# Altium project data_logger.PrjPcb
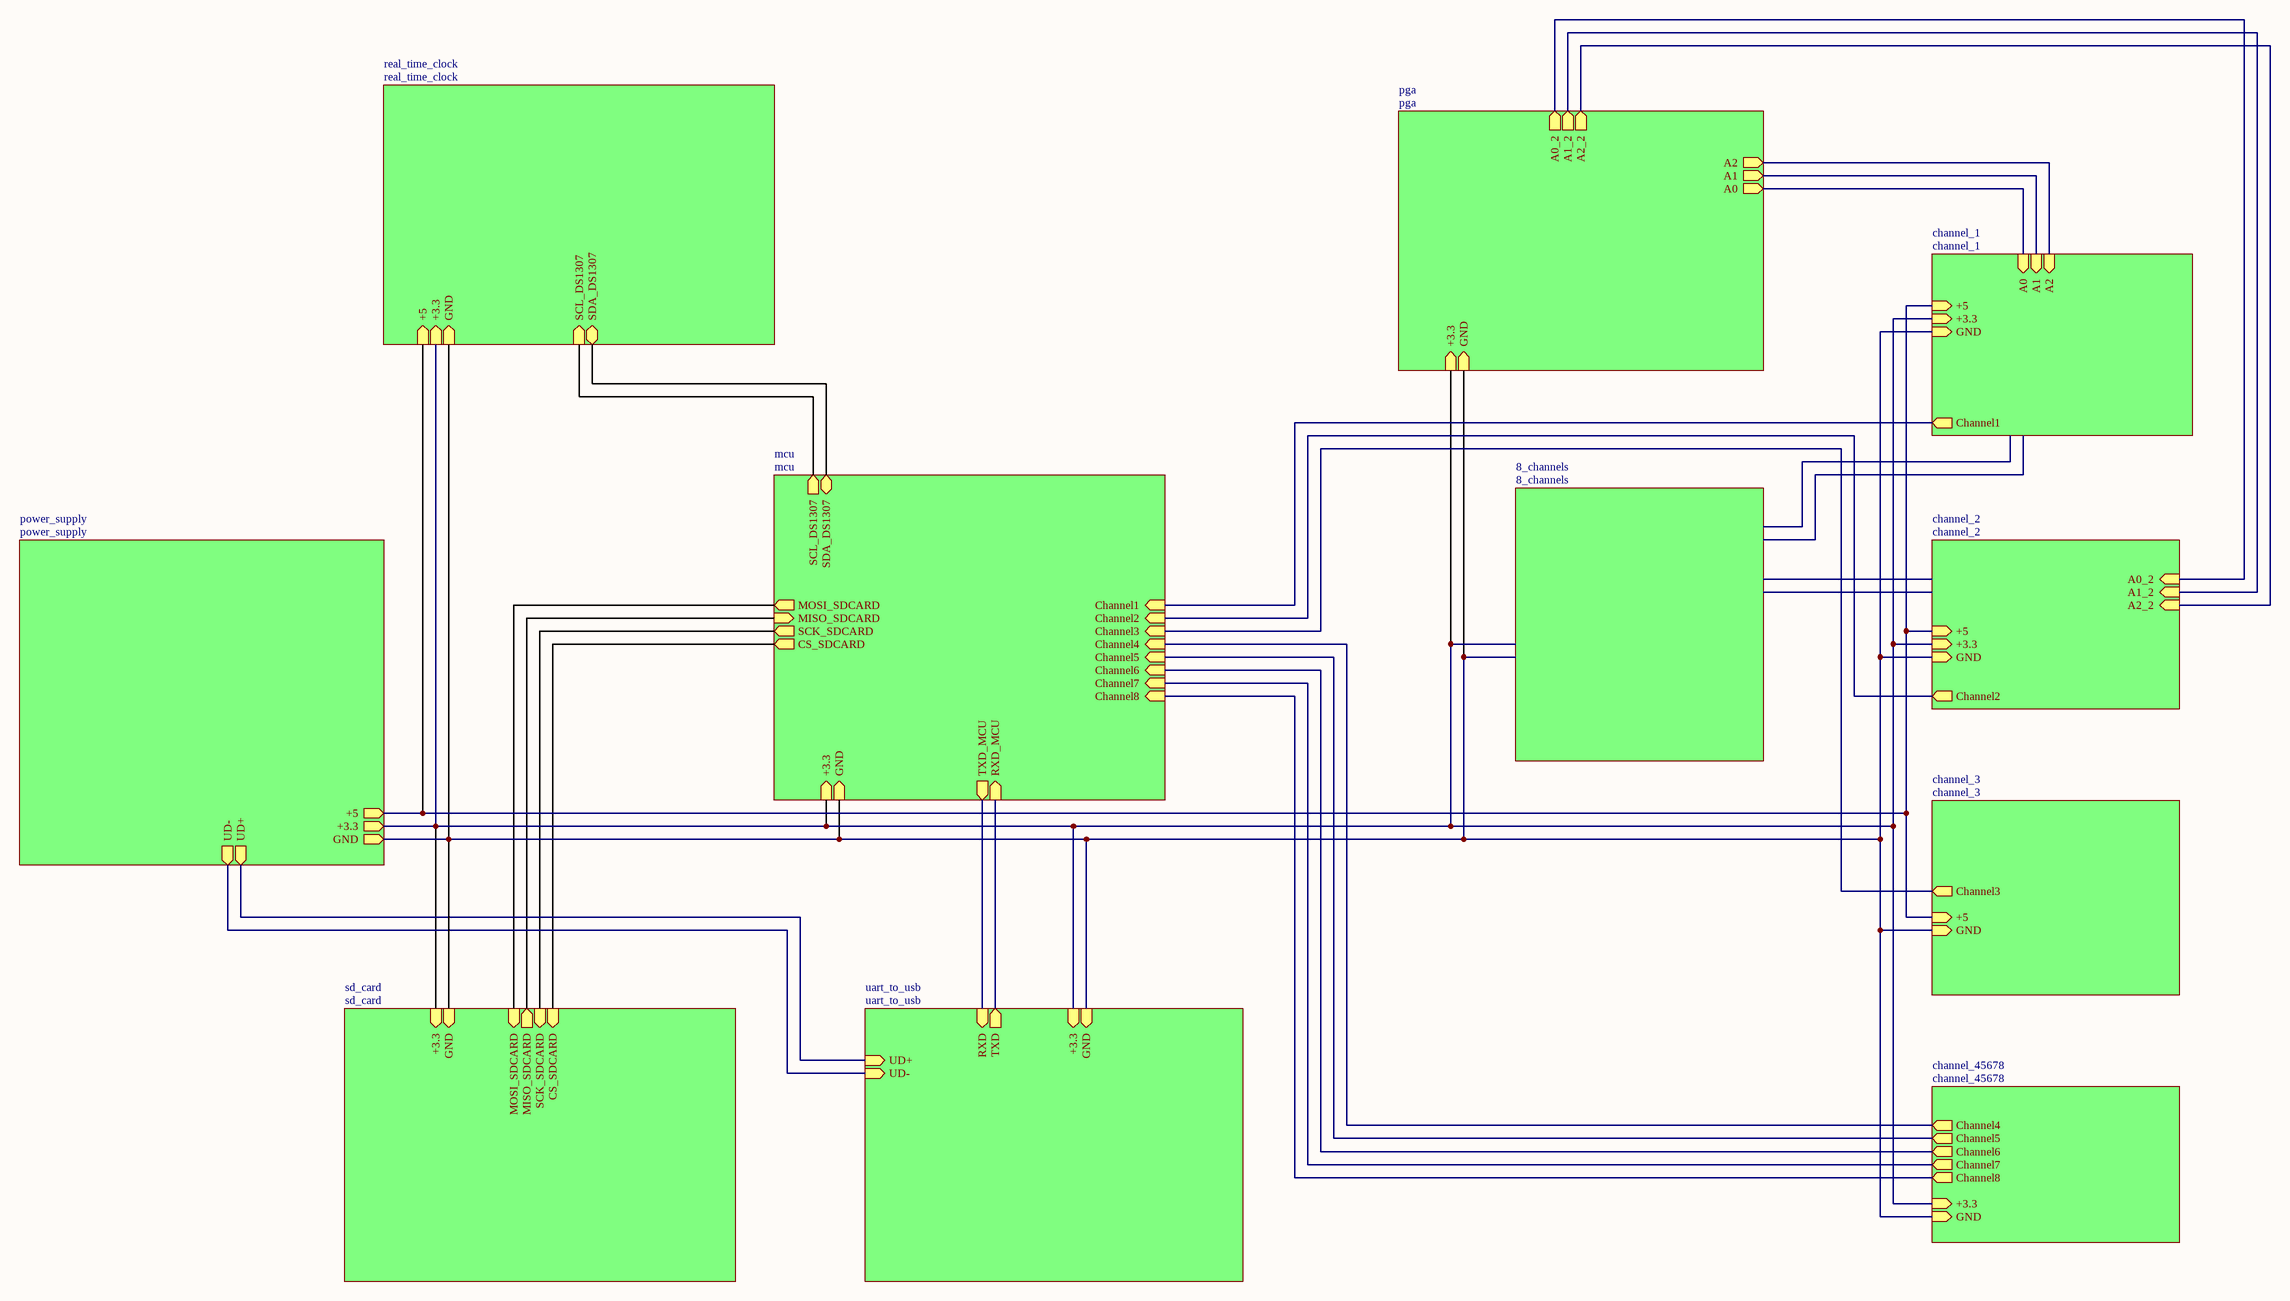
[diagram p0: data_logger.SchDoc]
12 sheets, 179 parts. Net scope: hierarchical (ports join the sheet entries above them; power ports are global).
Board file: data_logger.PcbDoc
Sheets:
  data_logger.SchDoc
    power_supply = power_supply.SchDoc
    real_time_clock = real_time_clock.SchDoc
    pga = pga.SchDoc
    sd_card = sd_card.SchDoc
    uart_to_usb = uart_to_usb.SchDoc
    mcu = mcu.SchDoc
    8_channels = 8_channels.SchDoc
    channel_1 = channel_1.SchDoc
    channel_2 = channel_2.SchDoc
    channel_3 = channel_3.SchDoc
    channel_45678 = channel_45678.SchDoc

## Sheet data_logger.SchDoc
size A2; SheetNumber: 1; SheetTotal: 12

### Sub-sheets
8_channels = 8_channels: no entries
channel_1 = channel_1: A2 (in), GND (in), Channel1 (out), +3.3 (in), A0 (in), A1 (in), +5 (in)
channel_2 = channel_2: GND (in), Channel2 (out), A2_2 (in), A1_2 (in), A0_2 (in), +3.3 (in), +5 (in)
channel_3 = channel_3: Channel3 (out), GND (in), +5 (in)
channel_45678 = channel_45678: Channel4 (out), Channel8 (out), Channel5 (out), Channel6 (out), Channel7 (out), GND (in), +3.3 (in)
mcu = mcu: Channel3 (in), MOSI_SDCARD (out), CS_SDCARD (out), GND (in), Channel7 (in), Channel6 (in), Channel1 (in), Channel4 (in), Channel2 (in), SCL_DS1307 (out), Channel5 (in), SCK_SDCARD (out), MISO_SDCARD (in), SDA_DS1307 (bidir), Channel8 (in), +3.3 (in), TXD_MCU (out), RXD_MCU (in)
pga = pga: GND (in), +3.3 (in), A2 (out), A0 (out), A1 (out), A0_2 (out), A1_2 (out), A2_2 (out)
power_supply = power_supply: GND (out), +3.3 (out), +5 (out), UD- (out), UD+ (out)
real_time_clock = real_time_clock: GND (in), +5 (in), SCL_DS1307 (in), SDA_DS1307 (bidir), +3.3 (in)
sd_card = sd_card: MISO_SDCARD (out), CS_SDCARD (in), SCK_SDCARD (in), GND (in), MOSI_SDCARD (in), +3.3 (in)
uart_to_usb = uart_to_usb: GND (in), +3.3 (in), RXD (in), TXD (out), UD+ (in), UD- (in)

### Nets
+3.3: sheet power_supply/+3.3, sheet real_time_clock/+3.3, sheet pga/+3.3, sheet sd_card/+3.3, sheet uart_to_usb/+3.3, sheet mcu/+3.3, sheet channel_1/+3.3, sheet channel_2/+3.3, sheet channel_45678/+3.3
+5: sheet power_supply/+5, sheet real_time_clock/+5, sheet channel_1/+5, sheet channel_2/+5, sheet channel_3/+5
GND: sheet power_supply/GND, sheet real_time_clock/GND, sheet pga/GND, sheet sd_card/GND, sheet uart_to_usb/GND, sheet mcu/GND, sheet channel_1/GND, sheet channel_2/GND, sheet channel_3/GND, sheet channel_45678/GND
Channel1: sheet mcu/Channel1, sheet channel_1/Channel1
Channel2: sheet mcu/Channel2, sheet channel_2/Channel2
Channel3: sheet mcu/Channel3, sheet channel_3/Channel3
Channel4: sheet mcu/Channel4, sheet channel_45678/Channel4
Channel5: sheet mcu/Channel5, sheet channel_45678/Channel5
Channel6: sheet mcu/Channel6, sheet channel_45678/Channel6
Channel7: sheet mcu/Channel7, sheet channel_45678/Channel7
Channel8: sheet mcu/Channel8, sheet channel_45678/Channel8
CS_SDCARD: sheet sd_card/CS_SDCARD, sheet mcu/CS_SDCARD
MISO_SDCARD: sheet sd_card/MISO_SDCARD, sheet mcu/MISO_SDCARD
MOSI_SDCARD: sheet sd_card/MOSI_SDCARD, sheet mcu/MOSI_SDCARD
RXD: sheet uart_to_usb/RXD, sheet mcu/TXD_MCU
RXD_MCU: sheet uart_to_usb/TXD, sheet mcu/RXD_MCU
SCK_SDCARD: sheet sd_card/SCK_SDCARD, sheet mcu/SCK_SDCARD
SCL_DS1307: sheet real_time_clock/SCL_DS1307, sheet mcu/SCL_DS1307
SDA_DS1307: sheet real_time_clock/SDA_DS1307, sheet mcu/SDA_DS1307
UD+: sheet power_supply/UD+, sheet uart_to_usb/UD+
UD-: sheet power_supply/UD-, sheet uart_to_usb/UD-
Net*2_13: sheet pga/A0, sheet channel_1/A0
Net*2_14: sheet pga/A1, sheet channel_1/A1
Net*2_15: sheet pga/A2, sheet channel_1/A2
Net*2_16: sheet pga/A0_2, sheet channel_2/A0_2
Net*2_17: sheet pga/A1_2, sheet channel_2/A1_2
Net*2_18: sheet pga/A2_2, sheet channel_2/A2_2

## Sheet power_supply.SchDoc
size A; SheetNumber: 2; SheetTotal: 12
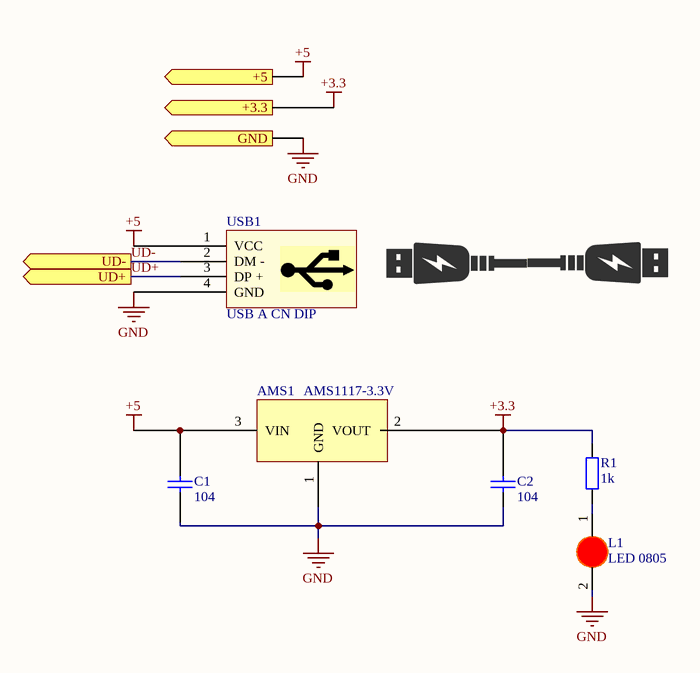
[diagram p1: power_supply.SchDoc]

### Parts
AMS1  AMS1117-3.3V  [SOT223]
C1  104  [tu 0603]
C2  104  [tu 0603]
L1  LED 0805  [LED-0805-Red]
R1  1k  [tro smd 0805]
USB1  USB A CN DIP  [USB A CN DIP]

### Ports
+3.3 (out), +5 (out), GND (out), UD+ (out), UD- (out)

### Nets
+3.3: AMS1.2(VOUT) C2.1 R1.2 ; port +3.3
+5: AMS1.3(VIN) C1.1 USB1.1(VCC) ; port +5
GND: AMS1.1(GND) C1.2 C2.2 L1.2(K) USB1.4(GND) ; port GND
UD+: USB1.3(DP_+) ; port UD+
UD-: USB1.2(DM_-) ; port UD-
NetL1_1: L1.1(A) R1.1

### Library data of the parts
AMS1 = AMS1117 SMD: Dán; Value: AMS1117-3.3V SOT223; Don_Vi: Con; Ma_Hang: MH000596; Ghi_Chu: *; Kieu_Chan: *; Chung_Loai: Dán
C1 C2 = Tu 0603 104 50V 10%: Dán; Don_Vi: Con; So_Chan: 2; Ten_Linh_Kien: Tụ 0603 104-100nF 10% 50V; Ma_Hang: MH004568; Chung_Loai: Dán; Kieu_Chan: *
L1 = LED 0805 Do: Dán; Don_Vi: Con; Ma_Hang: MH000897; Ten_Linh_Kien: LED 0805 Màu Đỏ (Red); Ghi_Chu: *; Kieu_Chan: *; Chung_Loai: Dán
R1 = Tro 0805 1% 1k: Dán; Don_Vi: Con; So_Chan: 2; Ten_Linh_Kien: Trở 0805 1% 1k; Ma_Hang: MH005468; Chung_Loai: Dán; Kieu_Chan: *
USB1 = USB A CN DIP: USB Type A; Ten: USB A Cái DIP; Ma_Hang: MH000941

## Sheet real_time_clock.SchDoc
size A; SheetNumber: 3; SheetTotal: 12
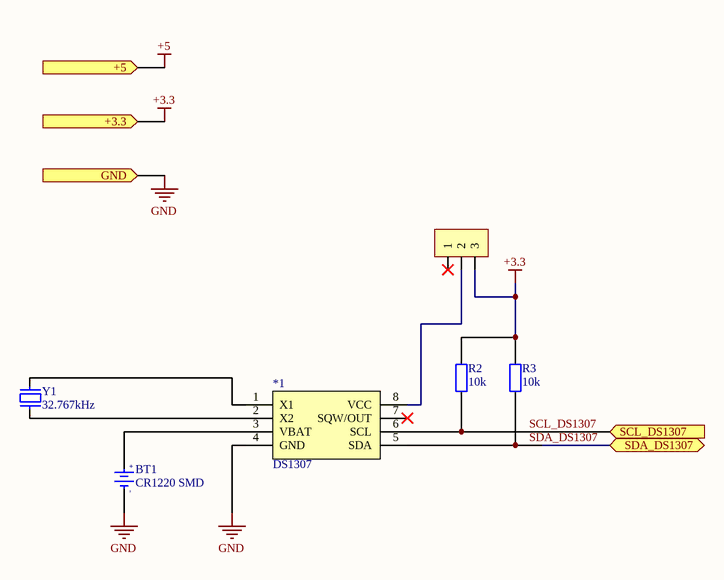
[diagram p2: real_time_clock.SchDoc]

### Parts
*1  DS1307  [SOIC 8]
BT1  CR1220 SMD  [DE PIN CR1220]
JP1  JP 1x3 2.54  [JP 1x3 DT]  (value not drawn)
R2  10k  [tro smd 0805]
R3  10k  [tro smd 0805]
Y1  32.767kHz  [Thach Anh 2 Chan 32,768 KHz]

### Ports
+3.3 (in), +5 (in), GND (in), SCL_DS1307 (in), SDA_DS1307 (bidir)

### Nets
+3.3: JP1.3 R2.2 R3.2 ; port +3.3
GND: *1.4(GND) BT1.2(GND) ; port GND
SCL_DS1307: *1.6(SCL) R2.1 ; port SCL_DS1307
SDA_DS1307: *1.5(SDA) R3.1 ; port SDA_DS1307
Net*1_1: *1.1(X1) Y1.2
Net*1_2: *1.2(X2) Y1.1
Net*1_3: *1.3(VBAT) BT1.1(+3V)
Net*1_8: *1.8(VCC) JP1.2

Not connected (* = marked no-connect by the designer): *1 7(SQW/OUT)*; JP1 1*

### Notes on the sheet
- (in symbol De pin CR1220 SMD) +; -

### Library data of the parts
BT1 = De pin CR1220 SMD: Ten: Đế PIN CR1220 SMD; Ma_Hang: MH000833
JP1 = JP 1x3 2.54 Duc Thang: Cắm; Ten_Linh_Kien: Jump Đơn Đực 2.54MM 1x40P Thẳng 11MM; Don_Vi: Con; Ma_Hang: MH000903; Ghi_Chu: *; Kieu_Chan: *; Chung_Loai: Cắm
R2 R3 = Tro 0805 1% 10k: Dán; Don_Vi: Con; So_Chan: 2; Ten_Linh_Kien: Trở 0805 1% 10k; Ma_Hang: MH005473; Chung_Loai: Dán; Kieu_Chan: *
Y1 = Thach Anh 2 chan 32,768 Khz: Crystal For all Crystal 2pin.; Value: 4Mhz

## Sheet pga.SchDoc
size A3; SheetNumber: 4; SheetTotal: 12
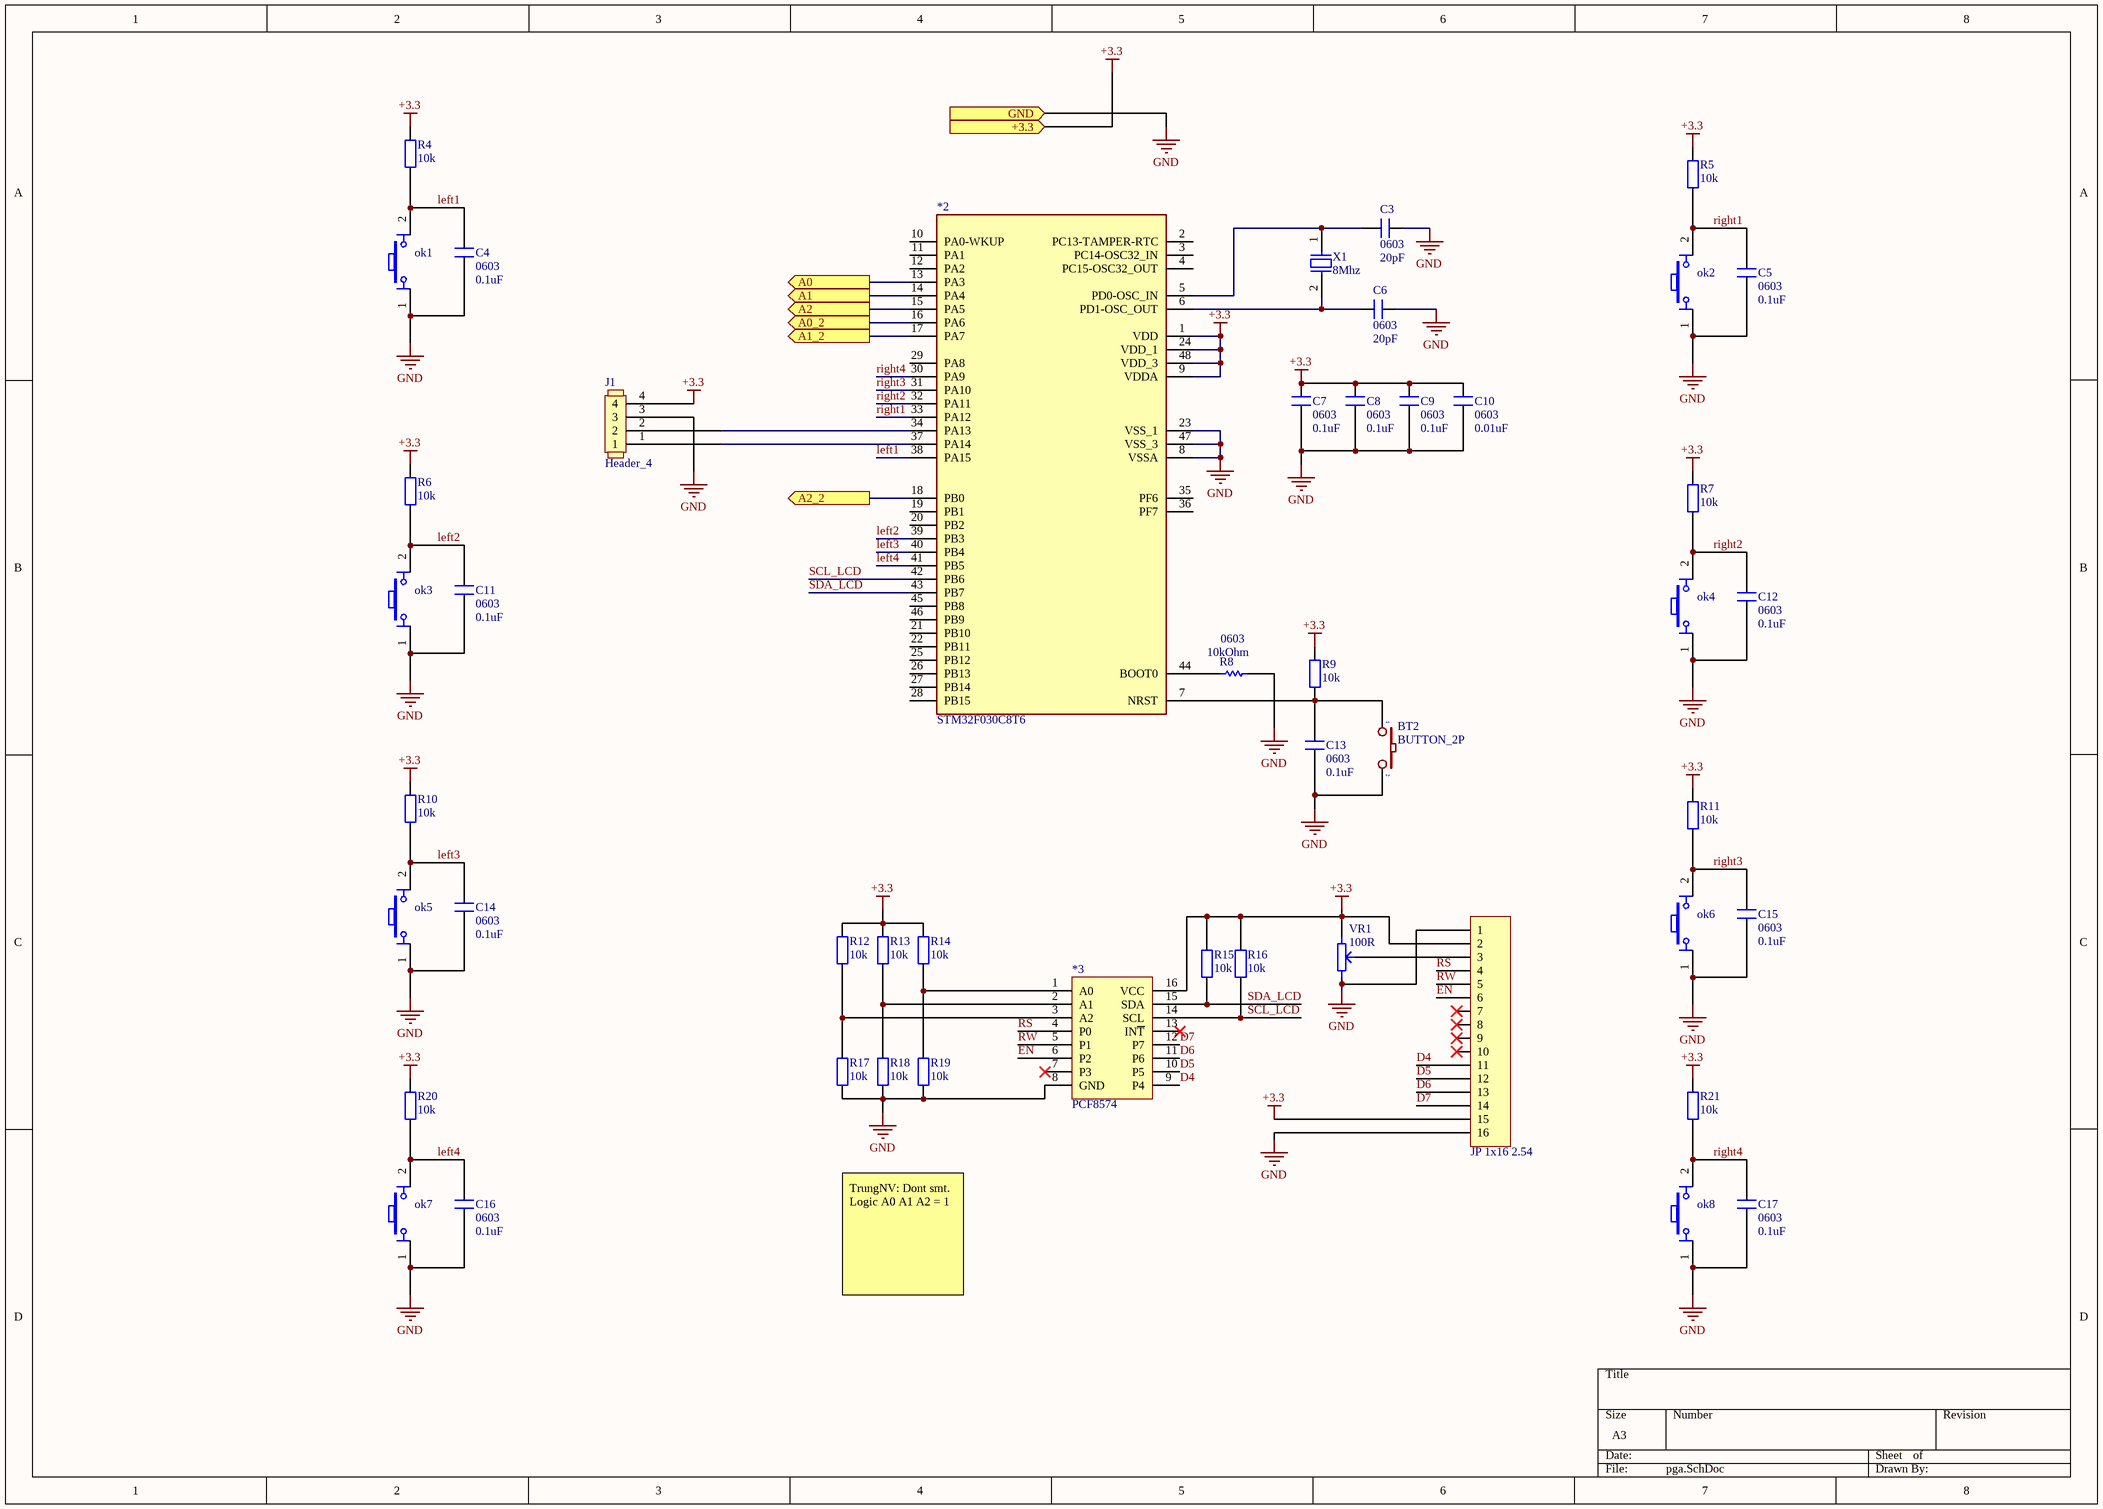
[diagram p3: pga.SchDoc]

### Parts
*2  STM32F030C8T6  [STM32_LQPF48]
*3  PCF8574  [SOIC 16]
BT2  BUTTON_2P  [BUTTON_2P_SMD]
C3  0603  value 20pF  [C_0603]
C4  0603  value 0.1uF  [C_0603]
C5  0603  value 0.1uF  [C_0603]
C6  0603  value 20pF  [C_0603]
C7  0603  value 0.1uF  [C_0603]
C8  0603  value 0.1uF  [C_0603]
C9  0603  value 0.1uF  [C_0603]
C10  0603  value 0.01uF  [C_0603]
C11  0603  value 0.1uF  [C_0603]
C12  0603  value 0.1uF  [C_0603]
C13  0603  value 0.1uF  [C_0603]
C14  0603  value 0.1uF  [C_0603]
C15  0603  value 0.1uF  [C_0603]
C16  0603  value 0.1uF  [C_0603]
C17  0603  value 0.1uF  [C_0603]
J1  Header_4  [HEADER_4_2P54_SHROUDED]
JP2  JP 1x16 2.54  [JP 1X16 DT]
ok1  Nut Nhan 4 Chan Cam 6x6  [Nut Nhan 4 Chan Cam 6x6]  (value not drawn)
ok2  Nut Nhan 4 Chan Cam 6x6  [Nut Nhan 4 Chan Cam 6x6]  (value not drawn)
ok3  Nut Nhan 4 Chan Cam 6x6  [Nut Nhan 4 Chan Cam 6x6]  (value not drawn)
ok4  Nut Nhan 4 Chan Cam 6x6  [Nut Nhan 4 Chan Cam 6x6]  (value not drawn)
ok5  Nut Nhan 4 Chan Cam 6x6  [Nut Nhan 4 Chan Cam 6x6]  (value not drawn)
ok6  Nut Nhan 4 Chan Cam 6x6  [Nut Nhan 4 Chan Cam 6x6]  (value not drawn)
ok7  Nut Nhan 4 Chan Cam 6x6  [Nut Nhan 4 Chan Cam 6x6]  (value not drawn)
ok8  Nut Nhan 4 Chan Cam 6x6  [Nut Nhan 4 Chan Cam 6x6]  (value not drawn)
R4  10k  [tro smd 0805]
R5  10k  [tro smd 0805]
R6  10k  [tro smd 0805]
R7  10k  [tro smd 0805]
R8  0603  value 10kOhm  [R_0603]
R9  10k  [tro smd 0805]
R10  10k  [tro smd 0805]
R11  10k  [tro smd 0805]
R12  10k  [tro smd 0805]
R13  10k  [tro smd 0805]
R14  10k  [tro smd 0805]
R15  10k  [tro smd 0805]
R16  10k  [tro smd 0805]
R17  10k  [tro smd 0805]
R18  10k  [tro smd 0805]
R19  10k  [tro smd 0805]
R20  10k  [tro smd 0805]
R21  10k  [tro smd 0805]
VR1  100R  [Bien Tro Tam Giac Dung]
X1  8Mhz  [XTAL_SMD_3P5]

### Ports
+3.3 (in), A0 (out), A0_2 (out), A1 (out), A1_2 (out), A2 (out), A2_2 (out), GND (in)

### Nets
+3.3: *2.1(VDD) *2.9(VDDA) *2.24(VDD_1) *2.48(VDD_3) *3.16(VCC) C7.2 C8.2 C9.2 C10.2 J1.4 JP2.2 JP2.15 R4.2 R5.2 R6.2 R7.2 R9.2 R10.2 R11.2 R12.2 R13.2 R14.2 R15.2 R16.2 R20.2 R21.2 VR1.1 ; port +3.3
GND: *2.8(VSSA) *2.23(VSS_1) *2.47(VSS_3) *3.8(GND) BT2.2 C3.2 C4.1 C5.1 C6.2 C7.1 C8.1 C9.1 C10.1 C11.1 C12.1 C13.1 C14.1 C15.1 C16.1 C17.1 J1.3 JP2.1 JP2.16 ok1.1 ok2.1 ok3.1 ok4.1 ok5.1 ok6.1 ok7.1 ok8.1 R8.2 R17.1 R18.1 R19.1 VR1.3 ; port GND
D4: *3.9(P4) JP2.11
D5: *3.10(P5) JP2.12
D6: *3.11(P6) JP2.13
D7: *3.12(P7) JP2.14
EN: *3.6(P2) JP2.6
left1: *2.38(PA15) C4.2 ok1.2 R4.1
left2: *2.39(PB3) C11.2 ok3.2 R6.1
left3: *2.40(PB4) C14.2 ok5.2 R10.1
left4: *2.41(PB5) C16.2 ok7.2 R20.1
right1: *2.33(PA12) C5.2 ok2.2 R5.1
right2: *2.32(PA11) C12.2 ok4.2 R7.1
right3: *2.31(PA10) C15.2 ok6.2 R11.1
right4: *2.30(PA9) C17.2 ok8.2 R21.1
RS: *3.4(P0) JP2.4
RW: *3.5(P1) JP2.5
SCL_LCD: *2.42(PB6) *3.14(SCL) R16.1
SDA_LCD: *2.43(PB7) *3.15(SDA) R15.1
Net*2_5: *2.5(PD0-OSC_IN) C3.1 X1.1
Net*2_6: *2.6(PD1-OSC_OUT) C6.1 X1.2
Net*2_7: *2.7(NRST) BT2.1 C13.2 R9.1
Net*2_13: *2.13(PA3) ; port A0
Net*2_14: *2.14(PA4) ; port A1
Net*2_15: *2.15(PA5) ; port A2
Net*2_16: *2.16(PA6) ; port A0_2
Net*2_17: *2.17(PA7) ; port A1_2
Net*2_18: *2.18(PB0) ; port A2_2
Net*2_34: *2.34(PA13) J1.2
Net*2_37: *2.37(PA14) J1.1
Net*2_44: *2.44(BOOT0) R8.1
Net*3_1: *3.1(A0) R14.1 R19.2
Net*3_2: *3.2(A1) R13.1 R18.2
Net*3_3: *3.3(A2) R12.1 R17.2
NetJP2_3: JP2.3 VR1.2

Not connected (* = marked no-connect by the designer): *2 2(PC13-TAMPER-RTC) 3(PC14-OSC32_IN) 4(PC15-OSC32_OUT) 10(PA0-WKUP) 11(PA1) 12(PA2) 19(PB1) 20(PB2) 21(PB10) 22(PB11) 25(PB12) 26(PB13) 27(PB14) 28(PB15) 29(PA8) 35(PF6) 36(PF7) 45(PB8) 46(PB9); *3 7(P3)* 13(IN~{T})*; JP2 7* 8* 9* 10*

### Notes on the sheet
- TrungNV: Dont smt. Logic A0 A1 A2 = 1

### Library data of the parts
BT2 = BUTTON_2P: Manufacturer: C&K; Part Number: PTS636 SM25F SMTR LFS; Part Code: S2000-000001; Point: 2; Value: BUTTON_2P; Description SEL: BUTTON_2P; Footprint Type: TH
C3 = Cap_Cer_0603_18pF: Ceramic Capacitor 0603  (+-10% TH)/(+10%SMD); Manufacturer: Murata Electronics; Part Number: GRM1885C1H180JA01J; Part Code: S1200-000093; Description SEL: CAP CER 18PF 50V C0G/NP0 0603; Point: 2; Footprint Type: SMD
C4 C5 C11 C12 C14-C17 = Cap_Cer_0603_0.1uF_50V: Ceramic Capacitor 0603  (+-10% TH)/(+10%SMD); Manufacturer: Murata Electronics; Part Number: GRM188R71H104KA93D; Part Code: S1200-000078; Description SEL: CAP CER 0.1UF 50V X7R 0603; Point: 2; Footprint Type: SMD
C6-C10 C13 = Cap_Cer_0603_0.1uF_25V: Ceramic Capacitor 0603  (+-10% TH)/(+10%SMD); Manufacturer: Murata Electronics; Part Number: GCM188R91E104KA37J; Part Code: S1200-000077; Description SEL: CAP CER 0.1UF 25V X8R 0603; Point: 2; Footprint Type: SMD
J1 = Header_4: Part Code: S1900-000023; Point: 4; Manufacturer: *; Part Number: *; Value: *; Description SEL: Header_4; Footprint Type: TH
JP2 = JP 1x16 2.54 Duc Thang: Cắm; Ten_Linh_Kien: Jump Đơn Đực 2.54MM 1x40P Thẳng 11MM; Don_Vi: Con; Ma_Hang: MH000903; Ghi_Chu: *; Kieu_Chan: *; Chung_Loai: Cắm
ok1-ok8 = Nut Nhan 4 Chan Cam 6x6: Nut Nhan 4 Chan 6x6mm; Ten: Nút Nhấn 4 Chân 6x6x5MM DIP; Ma_Hang: MH004584
R4-R7 R9-R21 = Tro 0805 1% 10k: as R2 on sheet real_time_clock; Chung_Loai: Dán; Kieu_Chan: *
R8 = Resistor_0603_10kOhm 1%: RES 10K OHM 1% 1/10W 0603; Manufacturer: YAGEO; Part Number: RC0603FR-7W10KL; Part Code: S1100-000043; Point: 2; Description SEL: RES 10K OHM 1% 1/10W 0603; Footprint Type: SMD; Power: 1/10W; Tolerance: 1%
VR1 = Bien tro tam giac 100R Dung: Cắm; Ten_Linh_Kien: Biến Trở Tam Giác 101-100R RM065; Don_Vi: Con; Ma_Hang: MH003710; Ghi_Chu: *; Kieu_Chan: *; Chung_Loai: Cắm
X1 = Xtal_2P_SMD_5P0X3P5_8Mhz: Use for 8Mhz; Manufacturer: WTL; Part Number: WTL5G11651; Part Code: S1600-000001; Description SEL: CRYSTAL 8.0000MHZ SURFACE MOUNT; Point: 2; Value: 8Mhz; Footprint Type: SMD

## Sheet sd_card.SchDoc
size A; SheetNumber: 5; SheetTotal: 9
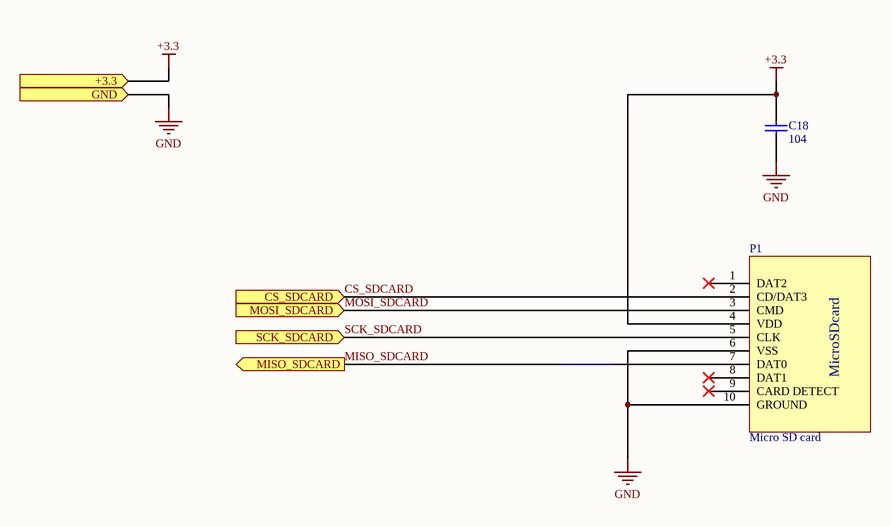
[diagram p4: sd_card.SchDoc]

### Parts
C18  104  [tu 0603]
P1  Micro SD card  [MicroSD]

### Ports
+3.3 (in), CS_SDCARD (in), GND (in), MISO_SDCARD (out), MOSI_SDCARD (in), SCK_SDCARD (in)

### Nets
+3.3: C18.1 P1.4(VDD) ; port +3.3
GND: C18.2 P1.6(VSS) P1.10(GROUND) ; port GND
CS_SDCARD: P1.2(CD/DAT3) ; port CS_SDCARD
MISO_SDCARD: P1.7(DAT0) ; port MISO_SDCARD
MOSI_SDCARD: P1.3(CMD) ; port MOSI_SDCARD
SCK_SDCARD: P1.5(CLK) ; port SCK_SDCARD

Not connected (* = marked no-connect by the designer): P1 1(DAT2)* 8(DAT1)* 9(CARD_DETECT)*

### Notes on the sheet
- (in symbol Micro SD card) MicroSDcard

### Library data of the parts
C18 = Tu 0603 104 50V 10%: as C1 on sheet power_supply; Chung_Loai: Dán; Kieu_Chan: *

## Sheet uart_to_usb.SchDoc
size A; SheetNumber: 6; SheetTotal: 12
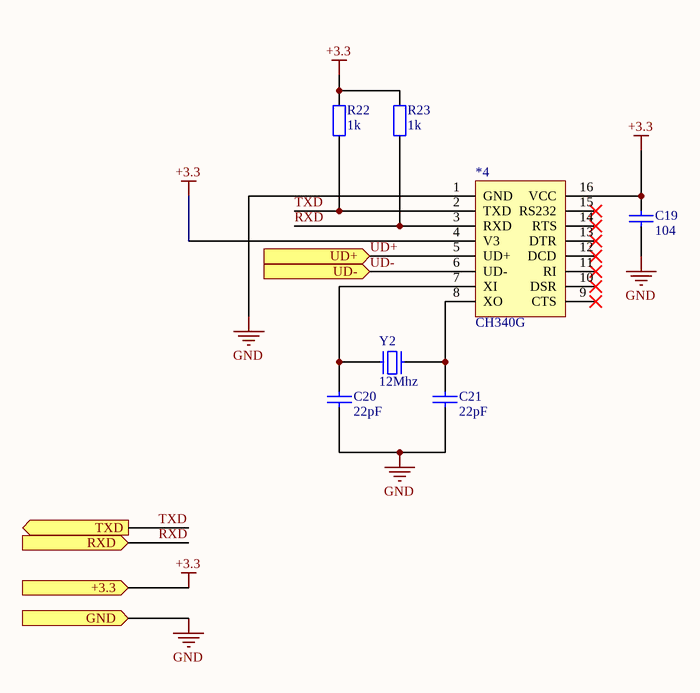
[diagram p5: uart_to_usb.SchDoc]

### Parts
*4  CH340G  [CH340G]
C19  104  [tu 0603]
C20  22pF  [tu 0603]
C21  22pF  [tu 0603]
R22  1k  [tro smd 0805]
R23  1k  [tro smd 0805]
Y2  12Mhz  [Thach Anh 2 chan cam]

### Ports
+3.3 (in), GND (in), RXD (in), TXD (out), UD+ (in), UD- (in)

### Nets
+3.3: *4.4(V3) *4.16(VCC) C19.1 R22.2 R23.2 ; port +3.3
GND: *4.1(GND) C19.2 C20.2 C21.2 ; port GND
RXD: *4.3(RXD) R23.1 ; port RXD
TXD: *4.2(TXD) R22.1 ; port TXD  [project net RXD_MCU]
UD+: *4.5(UD+) ; port UD+
UD-: *4.6(UD-) ; port UD-
Net*4_7: *4.7(XI) C20.1 Y2.1
Net*4_8: *4.8(XO) C21.1 Y2.2

Not connected (* = marked no-connect by the designer): *4 9(CTS)* 10(DSR)* 11(RI)* 12(DCD)* 13(DTR)* 14(RTS)* 15(RS232)*

### Library data of the parts
C19 = Tu 0603 104 50V 10%: as C1 on sheet power_supply; Chung_Loai: Dán; Kieu_Chan: *
C20 C21 = Tu 0603 22pF 50V 10%: Dán; Don_Vi: Con; So_Chan: 2; Ten_Linh_Kien: Tụ 0603 22pF 50V 10%; Ma_Hang: MH004570; Chung_Loai: Dán; Kieu_Chan: *
R22 R23 = Tro 0805 1% 1k: as R1 on sheet power_supply; Chung_Loai: Dán; Kieu_Chan: *
Y2 = Thach Anh 2 chan Cam: Crystal For all Crystal 2pin.; Value: 4Mhz

## Sheet mcu.SchDoc
size A; SheetNumber: 7; SheetTotal: 12
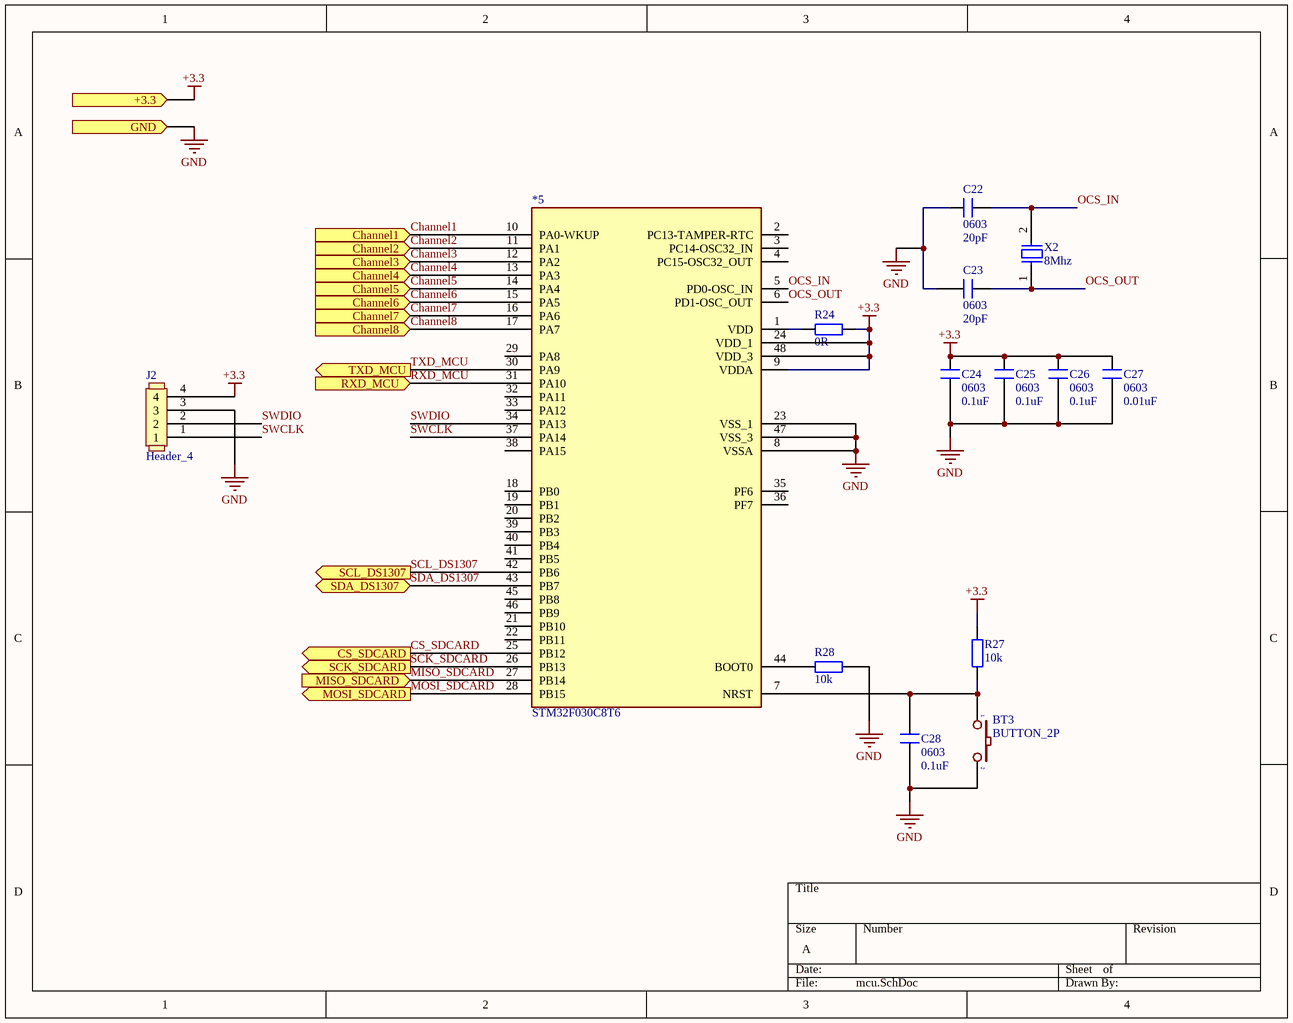
[diagram p6: mcu.SchDoc]

### Parts
*5  STM32F030C8T6  [STM32_LQPF48]
BT3  BUTTON_2P  [BUTTON_2P_SMD]
C22  0603  value 20pF  [C_0603]
C23  0603  value 20pF  [C_0603]
C24  0603  value 0.1uF  [C_0603]
C25  0603  value 0.1uF  [C_0603]
C26  0603  value 0.1uF  [C_0603]
C27  0603  value 0.01uF  [C_0603]
C28  0603  value 0.1uF  [C_0603]
J2  Header_4  [HEADER_4_2P54_SHROUDED]
R24  0R  [tro smd 0603]
R27  10k  [tro smd 0805]
R28  10k  [tro smd 0805]
X2  8Mhz  [XTAL_SMD_3P5]

### Ports
+3.3 (in), Channel1 (in), Channel2 (in), Channel3 (in), Channel4 (in), Channel5 (in), Channel6 (in), Channel7 (in), Channel8 (in), CS_SDCARD (out), GND (in), MISO_SDCARD (in), MOSI_SDCARD (out), RXD_MCU (in), SCK_SDCARD (out), SCL_DS1307 (out), SDA_DS1307 (bidir), TXD_MCU (out)

### Nets
+3.3: *5.9(VDDA) *5.24(VDD_1) *5.48(VDD_3) C24.2 C25.2 C26.2 C27.2 J2.4 R24.1 R27.2 ; port +3.3
GND: *5.8(VSSA) *5.23(VSS_1) *5.47(VSS_3) BT3.2 C22.2 C23.2 C24.1 C25.1 C26.1 C27.1 C28.1 J2.3 R28.1 ; port GND
Channel1: *5.10(PA0-WKUP) ; port Channel1
Channel2: *5.11(PA1) ; port Channel2
Channel3: *5.12(PA2) ; port Channel3
Channel4: *5.13(PA3) ; port Channel4
Channel5: *5.14(PA4) ; port Channel5
Channel6: *5.15(PA5) ; port Channel6
Channel7: *5.16(PA6) ; port Channel7
Channel8: *5.17(PA7) ; port Channel8
CS_SDCARD: *5.25(PB12) ; port CS_SDCARD
MISO_SDCARD: *5.27(PB14) ; port MISO_SDCARD
MOSI_SDCARD: *5.28(PB15) ; port MOSI_SDCARD
OCS_IN: *5.5(PD0-OSC_IN) C22.1 X2.2
OCS_OUT: *5.6(PD1-OSC_OUT) C23.1 X2.1
RXD_MCU: *5.31(PA10) ; port RXD_MCU
SCK_SDCARD: *5.26(PB13) ; port SCK_SDCARD
SCL_DS1307: *5.42(PB6) ; port SCL_DS1307
SDA_DS1307: *5.43(PB7) ; port SDA_DS1307
SWCLK: *5.37(PA14) J2.1
SWDIO: *5.34(PA13) J2.2
TXD_MCU: *5.30(PA9) ; port TXD_MCU  [project net RXD]
Net*5_1: *5.1(VDD) R24.2
Net*5_7: *5.7(NRST) BT3.1 C28.2 R27.1
Net*5_44: *5.44(BOOT0) R28.2

Not connected (* = marked no-connect by the designer): *5 2(PC13-TAMPER-RTC) 3(PC14-OSC32_IN) 4(PC15-OSC32_OUT) 18(PB0) 19(PB1) 20(PB2) 21(PB10) 22(PB11) 29(PA8) 32(PA11) 33(PA12) 35(PF6) 36(PF7) 38(PA15) 39(PB3) 40(PB4) 41(PB5) 45(PB8) 46(PB9)

### Library data of the parts
BT3 = BUTTON_2P: as BT2 on sheet pga; Value: BUTTON_2P; Description SEL: BUTTON_2P; Footprint Type: TH
C22 C23 = Cap_Cer_0603_18pF: as C3 on sheet pga; Footprint Type: SMD
C24-C28 = Cap_Cer_0603_0.1uF_25V: as C6 on sheet pga; Footprint Type: SMD
J2 = Header_4: Part Code: S1900-000023; Point: 4; Manufacturer: *; Part Number: *; Value: *; Description SEL: Header_4; Footprint Type: TH
R24 = Tro 0805 5% 0R: Dán; Don_Vi: Con; So_Chan: 2; Ten_Linh_Kien: Trở 0805 5% 0R; Ma_Hang: MH005230; Chung_Loai: Dán; Kieu_Chan: *
R27 R28 = Tro 0805 5% 10k: Dán; Don_Vi: Con; So_Chan: 2; Ten_Linh_Kien: Trở 0805 5% 10k; Ma_Hang: MH005239; Chung_Loai: Dán; Kieu_Chan: *
X2 = Xtal_2P_SMD_5P0X3P5_8Mhz: as X1 on sheet pga; Value: 8Mhz; Footprint Type: SMD

## Sheet 8_channels.SchDoc
size A2; SheetNumber: 8; SheetTotal: 12

## Sheet channel_1.SchDoc
size A3; SheetNumber: 9; SheetTotal: 12
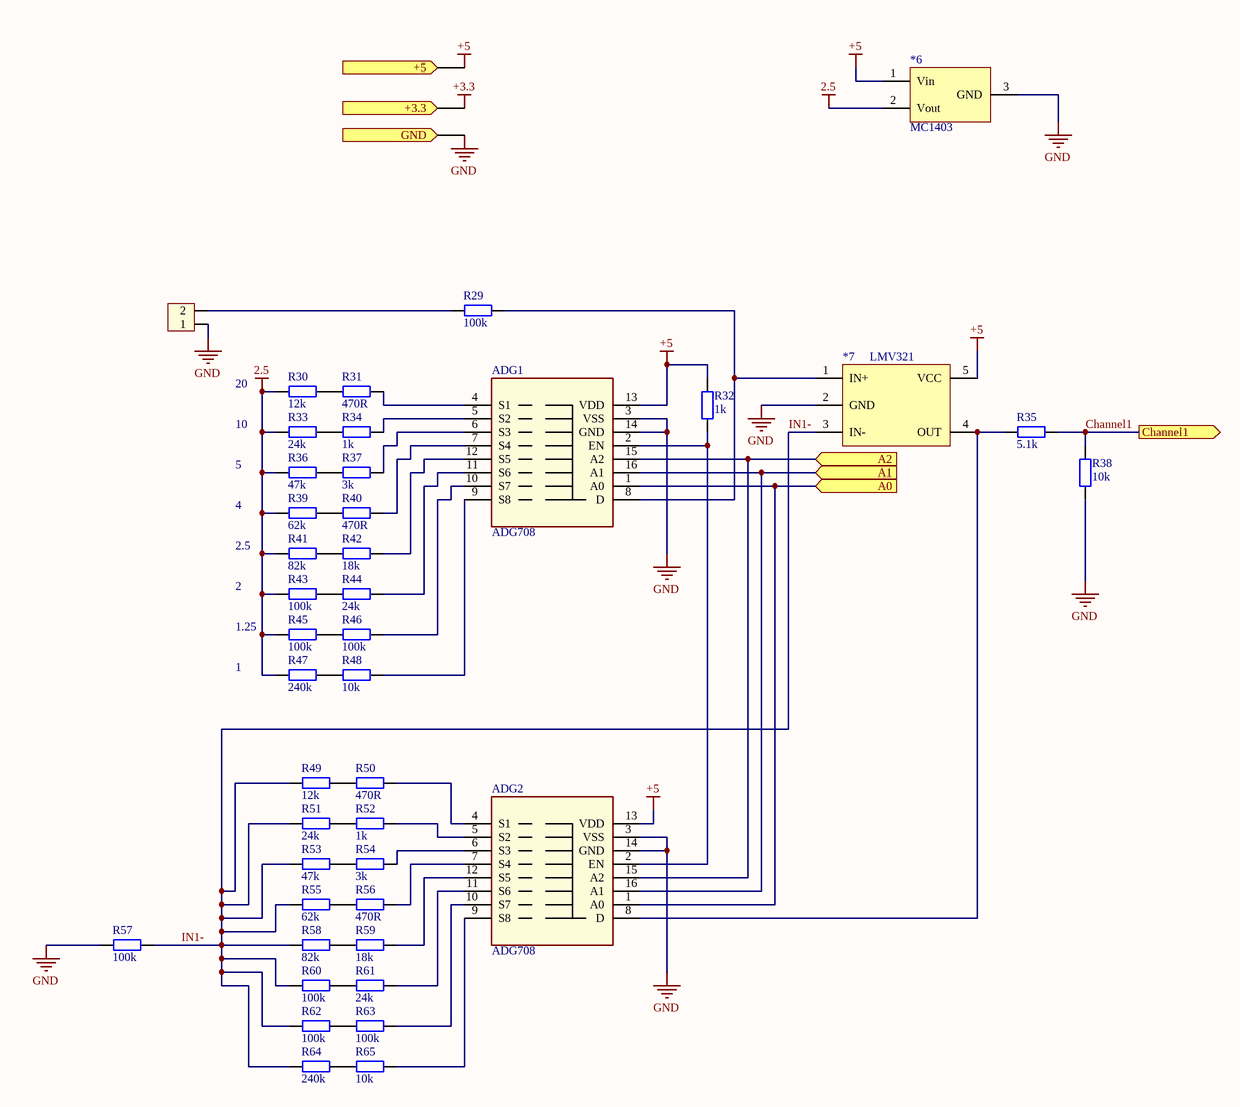
[diagram p7: channel_1.SchDoc]

### Parts
*6  MC1403  [dip8]
*7  LMV321  [SOT23-5]
ADG1  ADG708  [TSSOP16]
ADG2  ADG708  [TSSOP16]
H1  Header 2P 2.54 Duc Thang  [15EDGR-3.81-2P]  (value not drawn)
R29  100k  [tro smd 0603]
R30  12k  [tro smd 0603]
R31  470R  [tro smd 0603]
R32  1k  [tro smd 0603]
R33  24k  [tro smd 0603]
R34  1k  [tro smd 0603]
R35  5.1k  [tro smd 0603]
R36  47k  [tro smd 0603]
R37  3k  [tro smd 0603]
R38  10k  [tro smd 0603]
R39  62k  [tro smd 0603]
R40  470R  [tro smd 0603]
R41  82k  [tro smd 0603]
R42  18k  [tro smd 0603]
R43  100k  [tro smd 0603]
R44  24k  [tro smd 0603]
R45  100k  [tro smd 0603]
R46  100k  [tro smd 0603]
R47  240k  [tro smd 0603]
R48  10k  [tro smd 0603]
R49  12k  [tro smd 0603]
R50  470R  [tro smd 0603]
R51  24k  [tro smd 0603]
R52  1k  [tro smd 0603]
R53  47k  [tro smd 0603]
R54  3k  [tro smd 0603]
R55  62k  [tro smd 0603]
R56  470R  [tro smd 0603]
R57  100k  [tro smd 0603]
R58  82k  [tro smd 0603]
R59  18k  [tro smd 0603]
R60  100k  [tro smd 0603]
R61  24k  [tro smd 0603]
R62  100k  [tro smd 0603]
R63  100k  [tro smd 0603]
R64  240k  [tro smd 0603]
R65  10k  [tro smd 0603]

### Ports
+3.3 (in), +5 (in), A0 (in), A1 (in), A2 (in), Channel1 (out), GND (in)

### Nets
2.5: *6.2(Vout) R30.1 R33.1 R36.1 R39.1 R41.1 R43.2 R45.2 R47.2
+5: *6.1(Vin) *7.5(VCC) ADG1.13(VDD) ADG2.13(VDD) R32.2 ; port +5
GND: *6.3(GND) *7.2(GND) ADG1.3(VSS) ADG1.14(GND) ADG2.3(VSS) ADG2.14(GND) H1.1 R38.1 R57.2 ; port GND
Channel1: R35.2 R38.2 ; port Channel1
IN1-: *7.3(IN-) R49.1 R51.1 R53.1 R55.1 R57.1 R58.1 R60.2 R62.2 R64.2
Net*2_13: ADG1.1(A0) ADG2.1(A0) ; port A0
Net*2_14: ADG1.16(A1) ADG2.16(A1) ; port A1
Net*2_15: ADG1.15(A2) ADG2.15(A2) ; port A2
Net*7_1: *7.1(IN+) ADG1.8(D) R29.2
Net*7_4: *7.4(OUT) ADG2.8(D) R35.1
NetADG1_2: ADG1.2(EN) ADG2.2(EN) R32.1
NetADG1_4: ADG1.4(S1) R31.2
NetADG1_5: ADG1.5(S2) R34.2
NetADG1_6: ADG1.6(S3) R37.2
NetADG1_7: ADG1.7(S4) R40.2
NetADG1_9: ADG1.9(S8) R48.1
NetADG1_10: ADG1.10(S7) R46.1
NetADG1_11: ADG1.11(S6) R44.2
NetADG1_12: ADG1.12(S5) R42.2
NetADG2_4: ADG2.4(S1) R50.2
NetADG2_5: ADG2.5(S2) R52.2
NetADG2_6: ADG2.6(S3) R54.2
NetADG2_7: ADG2.7(S4) R56.2
NetADG2_9: ADG2.9(S8) R65.1
NetADG2_10: ADG2.10(S7) R63.1
NetADG2_11: ADG2.11(S6) R61.2
NetADG2_12: ADG2.12(S5) R59.2
NetH1_2: H1.2 R29.1
NetR30_2: R30.2 R31.1
NetR33_2: R33.2 R34.1
NetR36_2: R36.2 R37.1
NetR39_2: R39.2 R40.1
NetR41_2: R41.2 R42.1
NetR43_1: R43.1 R44.1
NetR45_1: R45.1 R46.2
NetR47_1: R47.1 R48.2
NetR49_2: R49.2 R50.1
NetR51_2: R51.2 R52.1
NetR53_2: R53.2 R54.1
NetR55_2: R55.2 R56.1
NetR58_2: R58.2 R59.1
NetR60_1: R60.1 R61.1
NetR62_1: R62.1 R63.2
NetR64_1: R64.1 R65.2

### Notes on the sheet
- 20
- 10
- 5
- 4
- 2.5
- 2
- 1.25
- 1

### Library data of the parts
H1 = Header 2P 2.54 Duc Thang: Cắm; Ten_Linh_Kien: Header 2P XH2.54-2P Đực Thẳng; Don_Vi: Con; Ma_Hang: MH001283; Chung_Loai: Cắm
R29 R43 R45-R48 R57 R60 R62-R65 = Tro 2512 5% 100k: Dán; Don_Vi: Con; So_Chan: 2; Ten_Linh_Kien: Trở 2512 5% 104-100k 1W; Ma_Hang: MH001941; Chung_Loai: Dán; Kieu_Chan: *
R30-R42 R44 R49-R56 R58 R59 R61 = Tro 0603 1% 10k: Dán; Don_Vi: Con; So_Chan: 2; Ten_Linh_Kien: Trở 0603 1% 10k; Ma_Hang: MH006333; Chung_Loai: Dán; Kieu_Chan: *

## Sheet channel_2.SchDoc
size A3; SheetNumber: 10; SheetTotal: 12
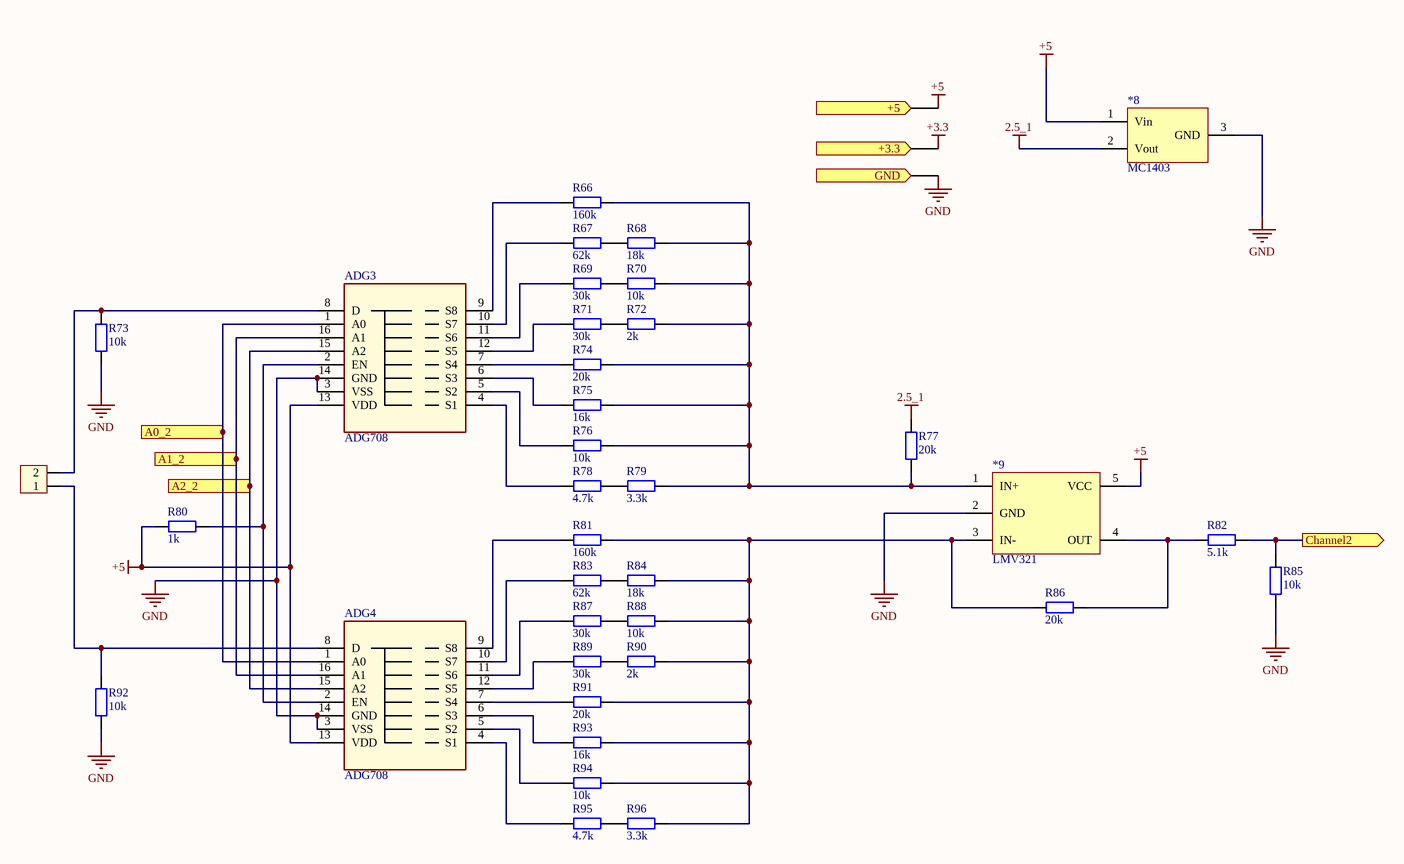
[diagram p8: channel_2.SchDoc]

### Parts
*8  MC1403  [dip8]
*9  LMV321  [SOT23-5]
ADG3  ADG708  [TSSOP16]
ADG4  ADG708  [TSSOP16]
H2  Header 2P 2.54 Duc Thang  [15EDGR-3.81-2P]  (value not drawn)
R66  160k  [tro smd 0603]
R67  62k  [tro smd 0603]
R68  18k  [tro smd 0603]
R69  30k  [tro smd 0603]
R70  10k  [tro smd 0603]
R71  30k  [tro smd 0603]
R72  2k  [tro smd 0603]
R73  10k  [tro smd 0603]
R74  20k  [tro smd 0603]
R75  16k  [tro smd 0603]
R76  10k  [tro smd 0603]
R77  20k  [tro smd 0603]
R78  4.7k  [tro smd 0603]
R79  3.3k  [tro smd 0603]
R80  1k  [tro smd 0603]
R81  160k  [tro smd 0603]
R82  5.1k  [tro smd 0603]
R83  62k  [tro smd 0603]
R84  18k  [tro smd 0603]
R85  10k  [tro smd 0603]
R86  20k  [tro smd 0603]
R87  30k  [tro smd 0603]
R88  10k  [tro smd 0603]
R89  30k  [tro smd 0603]
R90  2k  [tro smd 0603]
R91  20k  [tro smd 0603]
R92  10k  [tro smd 0603]
R93  16k  [tro smd 0603]
R94  10k  [tro smd 0603]
R95  4.7k  [tro smd 0603]
R96  3.3k  [tro smd 0603]

### Ports
+3.3 (in), +5 (in), A0_2 (in), A1_2 (in), A2_2 (in), Channel2 (out), GND (in)

### Nets
2.5_1: *8.2(Vout) R77.2
+5: *8.1(Vin) *9.5(VCC) ADG3.13(VDD) ADG4.13(VDD) R80.2 ; port +5
GND: *8.3(GND) *9.2(GND) ADG3.3(VSS) ADG3.14(GND) ADG4.3(VSS) ADG4.14(GND) R73.2 R85.1 R92.2 ; port GND
Channel2: R82.2 R85.2 ; port Channel2
Net*2_16: ADG3.1(A0) ADG4.1(A0) ; port A0_2
Net*2_17: ADG3.16(A1) ADG4.16(A1) ; port A1_2
Net*2_18: ADG3.15(A2) ADG4.15(A2) ; port A2_2
Net*9_1: *9.1(IN+) R66.2 R68.2 R70.2 R72.2 R74.2 R75.2 R76.2 R77.1 R79.2
Net*9_3: *9.3(IN-) R81.2 R84.2 R86.1 R88.2 R90.2 R91.2 R93.2 R94.2 R96.2
Net*9_4: *9.4(OUT) R82.1 R86.2
NetADG3_2: ADG3.2(EN) ADG4.2(EN) R80.1
NetADG3_4: ADG3.4(S1) R78.1
NetADG3_5: ADG3.5(S2) R76.1
NetADG3_6: ADG3.6(S3) R75.1
NetADG3_7: ADG3.7(S4) R74.1
NetADG3_8: ADG3.8(D) H2.2 R73.1
NetADG3_9: ADG3.9(S8) R66.1
NetADG3_10: ADG3.10(S7) R67.1
NetADG3_11: ADG3.11(S6) R69.1
NetADG3_12: ADG3.12(S5) R71.1
NetADG4_4: ADG4.4(S1) R95.1
NetADG4_5: ADG4.5(S2) R94.1
NetADG4_6: ADG4.6(S3) R93.1
NetADG4_7: ADG4.7(S4) R91.1
NetADG4_8: ADG4.8(D) H2.1 R92.1
NetADG4_9: ADG4.9(S8) R81.1
NetADG4_10: ADG4.10(S7) R83.1
NetADG4_11: ADG4.11(S6) R87.1
NetADG4_12: ADG4.12(S5) R89.1
NetR67_2: R67.2 R68.1
NetR69_2: R69.2 R70.1
NetR71_2: R71.2 R72.1
NetR78_2: R78.2 R79.1
NetR83_2: R83.2 R84.1
NetR87_2: R87.2 R88.1
NetR89_2: R89.2 R90.1
NetR95_2: R95.2 R96.1

### Library data of the parts
H2 = Header 2P 2.54 Duc Thang: as H1 on sheet channel_1; Chung_Loai: Cắm
R66-R81 R83 R84 R86-R96 = Tro 2512 5% 100k: as R29 on sheet channel_1; Chung_Loai: Dán; Kieu_Chan: *
R82 R85 = Tro 0603 1% 10k: as R30 on sheet channel_1; Chung_Loai: Dán; Kieu_Chan: *

## Sheet channel_3.SchDoc
size A; SheetNumber: 11; SheetTotal: 12
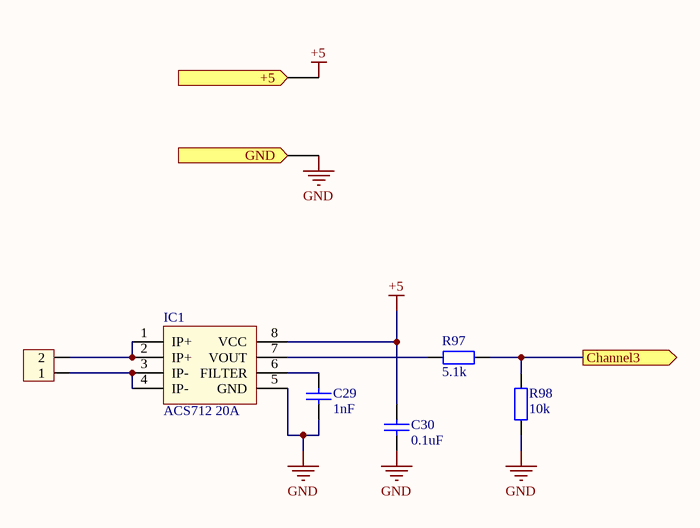
[diagram p9: channel_3.SchDoc]

### Parts
C29  1nF  [tu 0603]
C30  0.1uF  [tu 0603]
H3  Header 2P 2.54 Duc Thang  [15EDGR-3.81-2P]  (value not drawn)
IC1  ACS712 20A  [sop8]
R97  5.1k  [tro smd 0805]
R98  10k  [tro smd 0805]

### Ports
+5 (in), Channel3 (out), GND (in)

### Nets
+5: C30.1 IC1.8(VCC) ; port +5
GND: C29.2 C30.2 IC1.5(GND) R98.1 ; port GND
Channel3: R97.2 R98.2 ; port Channel3
NetC29_1: C29.1 IC1.6(FILTER)
NetH3_1: H3.1 IC1.3(IP-) IC1.4(IP-)
NetH3_2: H3.2 IC1.1(IP+) IC1.2(IP+)
NetIC1_7: IC1.7(VOUT) R97.1

### Library data of the parts
C29 C30 = Tu 0603 105 16V 20%: Dán; Don_Vi: Con; So_Chan: 2; Ten_Linh_Kien: Tụ 0603 105-1uF 20% 16V; Ma_Hang: MH004574; Chung_Loai: Dán; Kieu_Chan: *
H3 = Header 2P 2.54 Duc Thang: as H1 on sheet channel_1; Chung_Loai: Cắm
IC1 = ACS712: Cắm; Ten_Linh_Kien: AT24C01 DIP8 EEPROM 1KBIT; Ma_Hang: MH002775; Don_Vi: Con; Kieu_Chan: *; Ghi_Chu: *; Chung_Loai: Cắm
R97 R98 = Tro 0603 1% 10k: as R30 on sheet channel_1; Chung_Loai: Dán; Kieu_Chan: *

## Sheet channel_45678.SchDoc
size A2; SheetNumber: 12; SheetTotal: 12
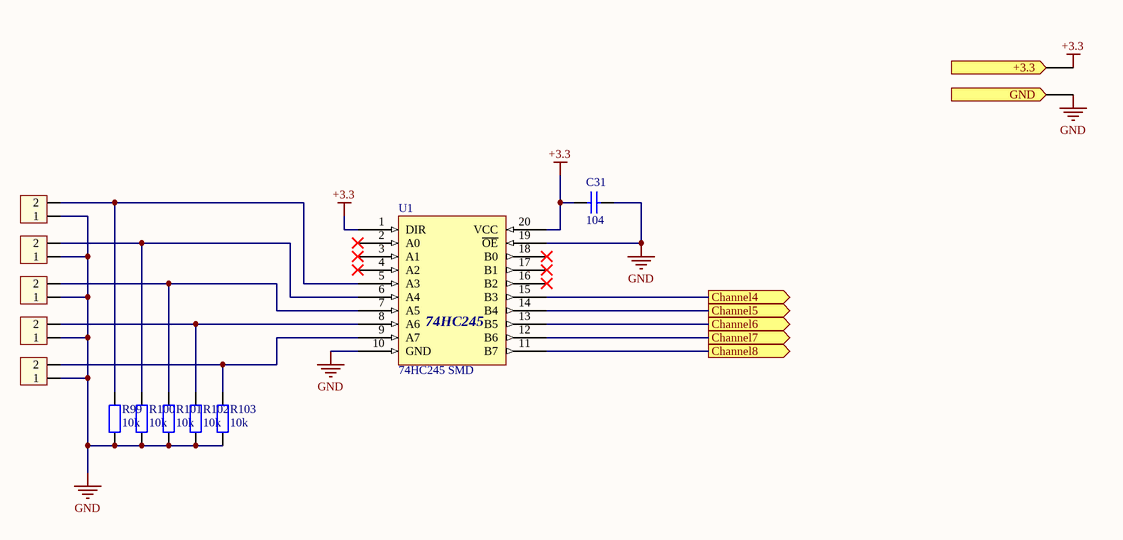
[diagram p10: channel_45678.SchDoc]

### Parts
C31  104  [tu 0603]
H4  Header 2P 2.54 Duc Thang  [15EDGR-3.81-2P]  (value not drawn)
H5  Header 2P 2.54 Duc Thang  [15EDGR-3.81-2P]  (value not drawn)
H6  Header 2P 2.54 Duc Thang  [15EDGR-3.81-2P]  (value not drawn)
H7  Header 2P 2.54 Duc Thang  [15EDGR-3.81-2P]  (value not drawn)
H8  Header 2P 2.54 Duc Thang  [15EDGR-3.81-2P]  (value not drawn)
R99  10k  [tro smd 0603]
R100  10k  [tro smd 0603]
R101  10k  [tro smd 0603]
R102  10k  [tro smd 0603]
R103  10k  [tro smd 0603]
U1  74HC245 SMD  [SOP 20]

### Ports
+3.3 (in), Channel4 (out), Channel5 (out), Channel6 (out), Channel7 (out), Channel8 (out), GND (in)

### Nets
+3.3: C31.2 U1.1(DIR) U1.20(VCC) ; port +3.3
GND: C31.1 H4.1 H5.1 H6.1 H7.1 H8.1 R99.1 R100.1 R101.1 R102.1 R103.1 U1.10(GND) U1.19(~{OE}) ; port GND
Channel4: U1.15(B3) ; port Channel4
Channel5: U1.14(B4) ; port Channel5
Channel6: U1.13(B5) ; port Channel6
Channel7: U1.12(B6) ; port Channel7
Channel8: U1.11(B7) ; port Channel8
NetH4_2: H4.2 R99.2 U1.5(A3)
NetH5_2: H5.2 R100.2 U1.6(A4)
NetH6_2: H6.2 R101.2 U1.7(A5)
NetH7_2: H7.2 R102.2 U1.8(A6)
NetH8_2: H8.2 R103.2 U1.9(A7)

Not connected (* = marked no-connect by the designer): U1 2(A0)* 3(A1)* 4(A2)* 16(B2)* 17(B1)* 18(B0)*

### Notes on the sheet
- (in symbol 74HC245 SMD) 74HC245

### Library data of the parts
C31 = Tu 0603 104 50V 10%: as C1 on sheet power_supply; Chung_Loai: Dán; Kieu_Chan: *
H4-H8 = Header 2P 2.54 Duc Thang: as H1 on sheet channel_1; Chung_Loai: Cắm
R99-R103 = Tro 0603 1% 10k: as R30 on sheet channel_1; Chung_Loai: Dán; Kieu_Chan: *
U1 = 74HC245 SMD: Dán; Ten_Linh_Kien: 74HC245DW SSOP20 5.2MM; Don_Vi: Con; Ma_Hang: MH003571; Ghi_Chu: *; Kieu_Chan: *; Chung_Loai: Dán

## Nets that join several sheets
+3.3: power_supply (AMS1.2 C2.1 R1.2), real_time_clock (JP1.3 R2.2 R3.2), pga (27 pins), sd_card (C18.1 P1.4), uart_to_usb (5 pins), mcu (10 pins), channel_45678 (C31.2 U1.1 U1.20)
+5: power_supply (AMS1.3 C1.1 USB1.1), channel_1 (5 pins), channel_2 (5 pins), channel_3 (C30.1 IC1.8)
GND: power_supply (5 pins), real_time_clock (*1.4 BT1.2), pga (36 pins), sd_card (C18.2 P1.6 P1.10), uart_to_usb (*4.1 C19.2 C20.2 C21.2), mcu (13 pins), channel_1 (9 pins), channel_2 (9 pins), channel_3 (C29.2 C30.2 IC1.5 R98.1), channel_45678 (13 pins)
Channel1: mcu (*5.10), channel_1 (R35.2 R38.2)
Channel2: mcu (*5.11), channel_2 (R82.2 R85.2)
Channel3: mcu (*5.12), channel_3 (R97.2 R98.2)
Channel4: mcu (*5.13), channel_45678 (U1.15)
Channel5: mcu (*5.14), channel_45678 (U1.14)
Channel6: mcu (*5.15), channel_45678 (U1.13)
Channel7: mcu (*5.16), channel_45678 (U1.12)
Channel8: mcu (*5.17), channel_45678 (U1.11)
CS_SDCARD: sd_card (P1.2), mcu (*5.25)
MISO_SDCARD: sd_card (P1.7), mcu (*5.27)
MOSI_SDCARD: sd_card (P1.3), mcu (*5.28)
Net*2_13: pga (*2.13), channel_1 (ADG1.1 ADG2.1)
Net*2_14: pga (*2.14), channel_1 (ADG1.16 ADG2.16)
Net*2_15: pga (*2.15), channel_1 (ADG1.15 ADG2.15)
Net*2_16: pga (*2.16), channel_2 (ADG3.1 ADG4.1)
Net*2_17: pga (*2.17), channel_2 (ADG3.16 ADG4.16)
Net*2_18: pga (*2.18), channel_2 (ADG3.15 ADG4.15)
RXD: uart_to_usb (*4.3 R23.1), mcu (*5.30)
RXD_MCU: uart_to_usb (*4.2 R22.1), mcu (*5.31)
SCK_SDCARD: sd_card (P1.5), mcu (*5.26)
SCL_DS1307: real_time_clock (*1.6 R2.1), mcu (*5.42)
SDA_DS1307: real_time_clock (*1.5 R3.1), mcu (*5.43)
UD+: power_supply (USB1.3), uart_to_usb (*4.5)
UD-: power_supply (USB1.2), uart_to_usb (*4.6)